# Altium schematic sheet STM32F103C8T6_Core.SchDoc
size A4
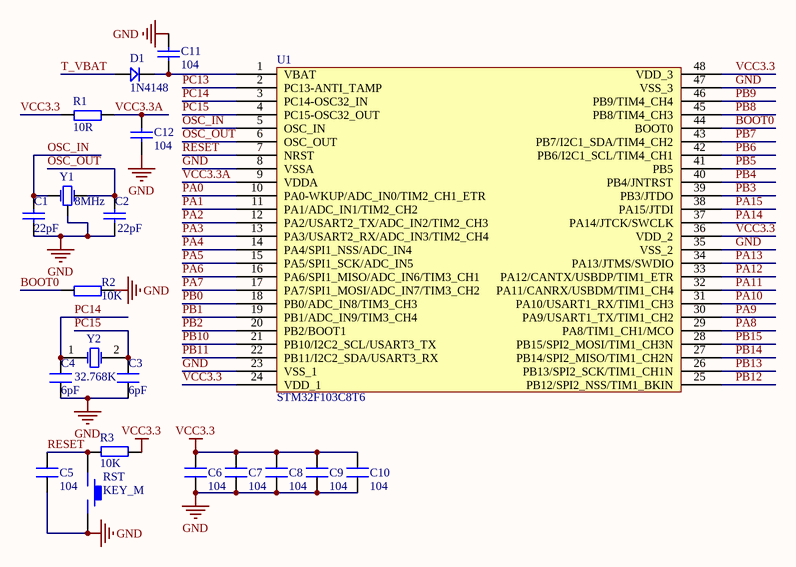
[diagram p0: STM32F103C8T6_Core.SchDoc]

## Parts
C1  22pF  [C 0603_M]
C2  22pF  [C 0603_M]
C3  6pF  [C 0603_M]
C4  6pF  [C 0603_M]
C5  104  [C 0603_M]
C6  104  [C 0603_M]
C7  104  [C 0603_M]
C8  104  [C 0603_M]
C9  104  [C 0603_M]
C10  104  [C 0603_M]
C11  104  [C 0603_M]
C12  104  [C 0603_M]
D1  1N4148  [DIODE_SOP]
R1  10R  [R 0603_M]
R2  10K  [R 0603_M]
R3  10K  [R 0603_M]
RST  KEY_M  [TSW SMD-3*6*2.5]
U1  STM32F103C8T6  [LQFP-48PIN]
Y1  8MHz  [Y-XTAL-3215-3P]
Y2  32.768K  [OSC 3215-2P]

## Nets
GND: C1.1 C2.1 C3.1 C4.1 C5.1 C6.1 C7.1 C8.1 C9.1 C10.1 C11.2 C12.1 R2.2 RST.2 U1.8(VSSA) U1.23(VSS_1) U1.35(VSS_2) U1.47(VSS_3) Y1.2(GND)
VCC3.3: C6.2 C7.2 C8.2 C9.2 C10.2 R1.1 R3.1 U1.24(VDD_1) U1.36(VDD_2) U1.48(VDD_3)
BOOT0: R2.1 U1.44(BOOT0)
OSC_IN: C1.2 U1.5(OSC_IN) Y1.1(OSC1)
OSC_OUT: C2.2 U1.6(OSC_OUT) Y1.3(OSC2)
PA0: U1.10(PA0-WKUP/ADC_IN0/TIM2_CH1_ETR)
PA1: U1.11(PA1/ADC_IN1/TIM2_CH2)
PA2: U1.12(PA2/USART2_TX/ADC_IN2/TIM2_CH3)
PA3: U1.13(PA3/USART2_RX/ADC_IN3/TIM2_CH4)
PA4: U1.14(PA4/SPI1_NSS/ADC_IN4)
PA5: U1.15(PA5/SPI1_SCK/ADC_IN5)
PA6: U1.16(PA6/SPI1_MISO/ADC_IN6/TIM3_CH1)
PA7: U1.17(PA7/SPI1_MOSI/ADC_IN7/TIM3_CH2)
PA8: U1.29(PA8/TIM1_CH1/MCO)
PA9: U1.30(PA9/USART1_TX/TIM1_CH2)
PA10: U1.31(PA10/USART1_RX/TIM1_CH3)
PA11: U1.32(PA11/CANRX/USBDM/TIM1_CH4)
PA12: U1.33(PA12/CANTX/USBDP/TIM1_ETR)
PA13: U1.34(PA13/JTMS/SWDIO)
PA14: U1.37(PA14/JTCK/SWCLK)
PA15: U1.38(PA15/JTDI)
PB0: U1.18(PB0/ADC_IN8/TIM3_CH3)
PB1: U1.19(PB1/ADC_IN9/TIM3_CH4)
PB2: U1.20(PB2/BOOT1)
PB3: U1.39(PB3/JTDO)
PB4: U1.40(PB4/JNTRST)
PB5: U1.41(PB5)
PB6: U1.42(PB6/I2C1_SCL/TIM4_CH1)
PB7: U1.43(PB7/I2C1_SDA/TIM4_CH2)
PB8: U1.45(PB8/TIM4_CH3)
PB9: U1.46(PB9/TIM4_CH4)
PB10: U1.21(PB10/I2C2_SCL/USART3_TX)
PB11: U1.22(PB11/I2C2_SDA/USART3_RX)
PB12: U1.25(PB12/SPI2_NSS/TIM1_BKIN)
PB13: U1.26(PB13/SPI2_SCK/TIM1_CH1N)
PB14: U1.27(PB14/SPI2_MISO/TIM1_CH2N)
PB15: U1.28(PB15/SPI2_MOSI/TIM1_CH3N)
PC13: U1.2(PC13-ANTI_TAMP)
PC14: C4.2 U1.3(PC14-OSC32_IN) Y2.1(OSC1)
PC15: C3.2 U1.4(PC15-OSC32_OUT) Y2.2(OSC2)
RESET: C5.2 R3.2 RST.1 U1.7(NRST)
T_VBAT: D1.1
VCC3.3A: C12.2 R1.2 U1.9(VDDA)
NetC11_1: C11.1 D1.2 U1.1(VBAT)

## Library data of the parts
C1 C2 C11 C12 = CAP
C3-C10 = C
D1 = D
R1-R3 = R
U1 = U-STM32F103C8T6
Y1 = Y-3215-8M: XTAL,3215,8MHz
Y2 = XTAL: Crystal Oscillator; Published: 8-Jun-2000; LatestRevisionDate: 17-Jul-2002; LatestRevisionNote: Re-released for DXP Platform.; Publisher: Altium Limited